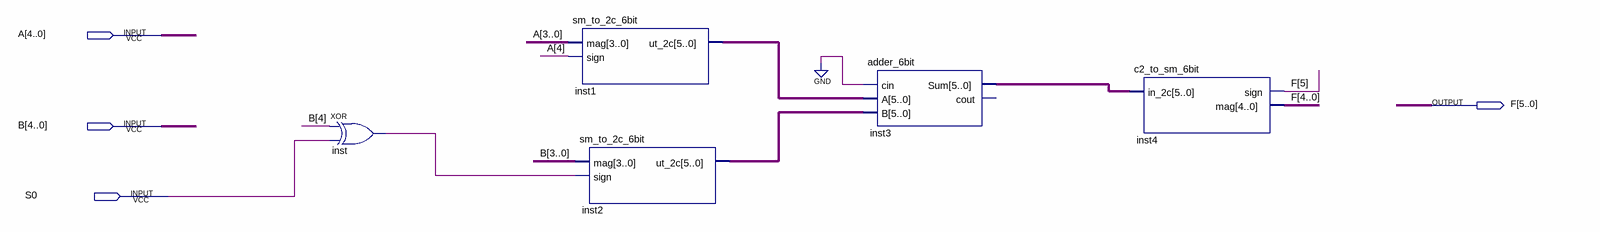
[diagram p0: schematic sheet]
// Quartus schematic add_sub_unit.bdf as structural Verilog: 5 symbols, 4 pins
module add_sub_unit (
  input  [4:0] A,
  input  [4:0] B,
  input  S0,
  output [5:0] F
);

  wire inst_out;
  wire [5:0] inst1_ut_2c, inst2_ut_2c, inst3_sum;

  xor inst (inst_out, B[4], S0);
  sm_to_2c_6bit inst1 (.mag(A[3:0]), .sign(A[4]), .ut_2c(inst1_ut_2c));
  sm_to_2c_6bit inst2 (.mag(B[3:0]), .sign(inst_out), .ut_2c(inst2_ut_2c));
  adder_6bit inst3 (.cin(1'b0), .A(inst1_ut_2c), .B(inst2_ut_2c), .Sum(inst3_sum));  // open: cout
  c2_to_sm_6bit inst4 (.in_2c(inst3_sum), .sign(F[5]), .mag(F[4:0]));
endmodule
